# EAGLE design PowerBoard (EAGLE 6.6.0)
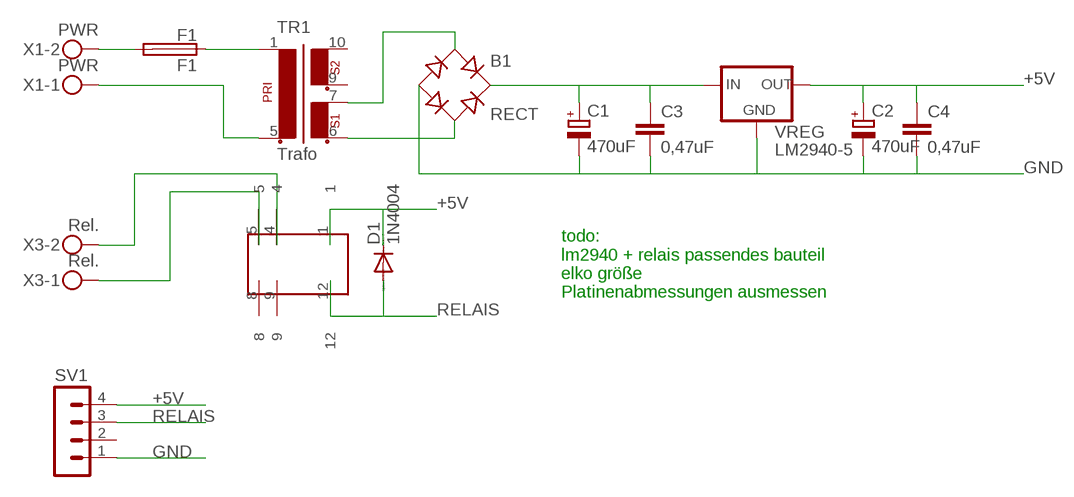
[diagram p0: schematic, sheet 1]

## Parts
B1  RECT  RECTIFIER-1KAB  [1KAB]
C1  470uF  CPOL-EUE5-6  [E5-6]
C2  470uF  CPOL-EUE5-6  [E5-6]
C3  0,47uF  C-EU025-030X050  [C025-030X050]
C4  0,47uF  C-EU025-030X050  [C025-030X050]
D1  1N4004  [DO41-10]
F1  F1  FUSEBLANK_5X20MM  [FUSE_HOLDER_5X20MM]
SV1  MA04-1  [MA04-1]
TR1  Trafo  EI30-2  [EI30-2]
U$1  V23079-A  [V23079-A]
VREG  LM2940-5  78MXXS  [78MXXS]
X1  PWR  MKDSN1,5/2-5,08  [MKDSN1,5/2-5,08]
X3  Rel.  MKDSN1,5/2-5,08  [MKDSN1,5/2-5,08]

## Nets
+5V: C2.+ C4.1 D1.C SV1.4 U$1.1 VREG.OUT
GND: B1.- C1.- C2.- C3.2 C4.2 SV1.1 VREG.GND
N$1: B1.AC2 TR1.6
N$2: B1.AC1 TR1.7
N$3: U$1.4 X3.2
N$4: B1.+ C1.+ C3.1 VREG.IN
N$5: U$1.5 X3.1
N$6: TR1.5 X1.1
N$7: F1.2 X1.2
RELAIS: D1.A SV1.3 U$1.12
TRAFO: F1.1 TR1.1
Unconnected: SV1.2 TR1.9 TR1.10 U$1.8 U$1.9

## Notes on the sheet
- todo:
  lm2940 + relais passendes bauteil
  elko größe
  Platinenabmessungen ausmessen

## Library data of the parts
B1 = rectifier:RECTIFIER-: Rectifier
C1 C2 = rcl:CPOL-EU: POLARIZED CAPACITOR, European symbol
C3 C4 = rcl:C-EU: CAPACITOR, European symbol
D1 = diode:1N4004: DIODE general purpose rectifier, 1 A
F1 = fuse:FUSE: Fuse; OC_FARNELL: unknown; OC_NEWARK: unknown
SV1 = con-lstb:MA04-1: PIN HEADER; OC_FARNELL: unknown; OC_NEWARK: unknown
TR1 = trafo:EI30-2: TRANSFORMER 1 primary winding, 2 secondary windings ERA
U$1 = Relais:V23079-A
VREG = v-reg:78MXXS: VOLTAGE REGULATOR
X1 X3 = con-phoenix-508:MKDSN1,5/2-5,08: MKDSN 1,5/ 2-5,08 Printklemme Nennstrom: 13,5 A Nennspannung: 250 V Rastermaß: 5,08 mm Polzahl: 2 Anschlussart: Schraubanschluss Montage: Löten Anschlussrichtung Leiter/Platine: 0 ° Artikelnummer: 1729128 Source: http://eshop.phoenixcontact.com .. 1729128.pdf

## Board
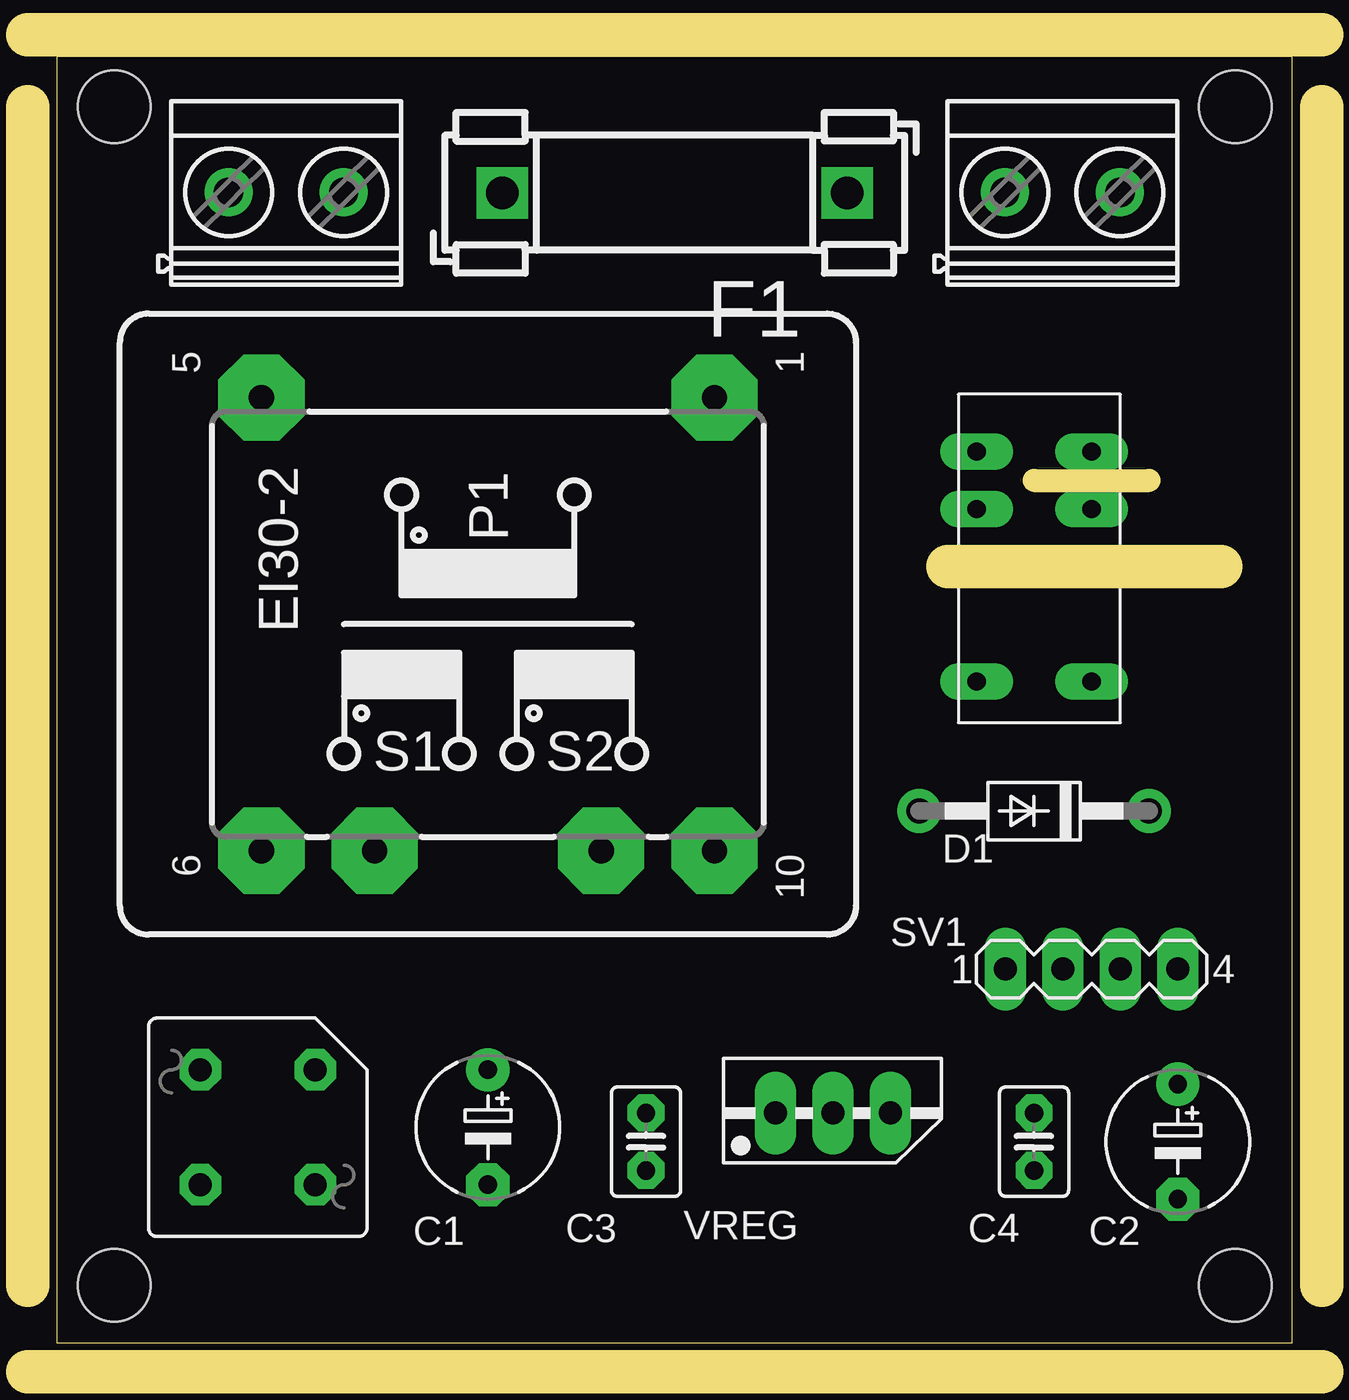
[diagram p1: board, top side]
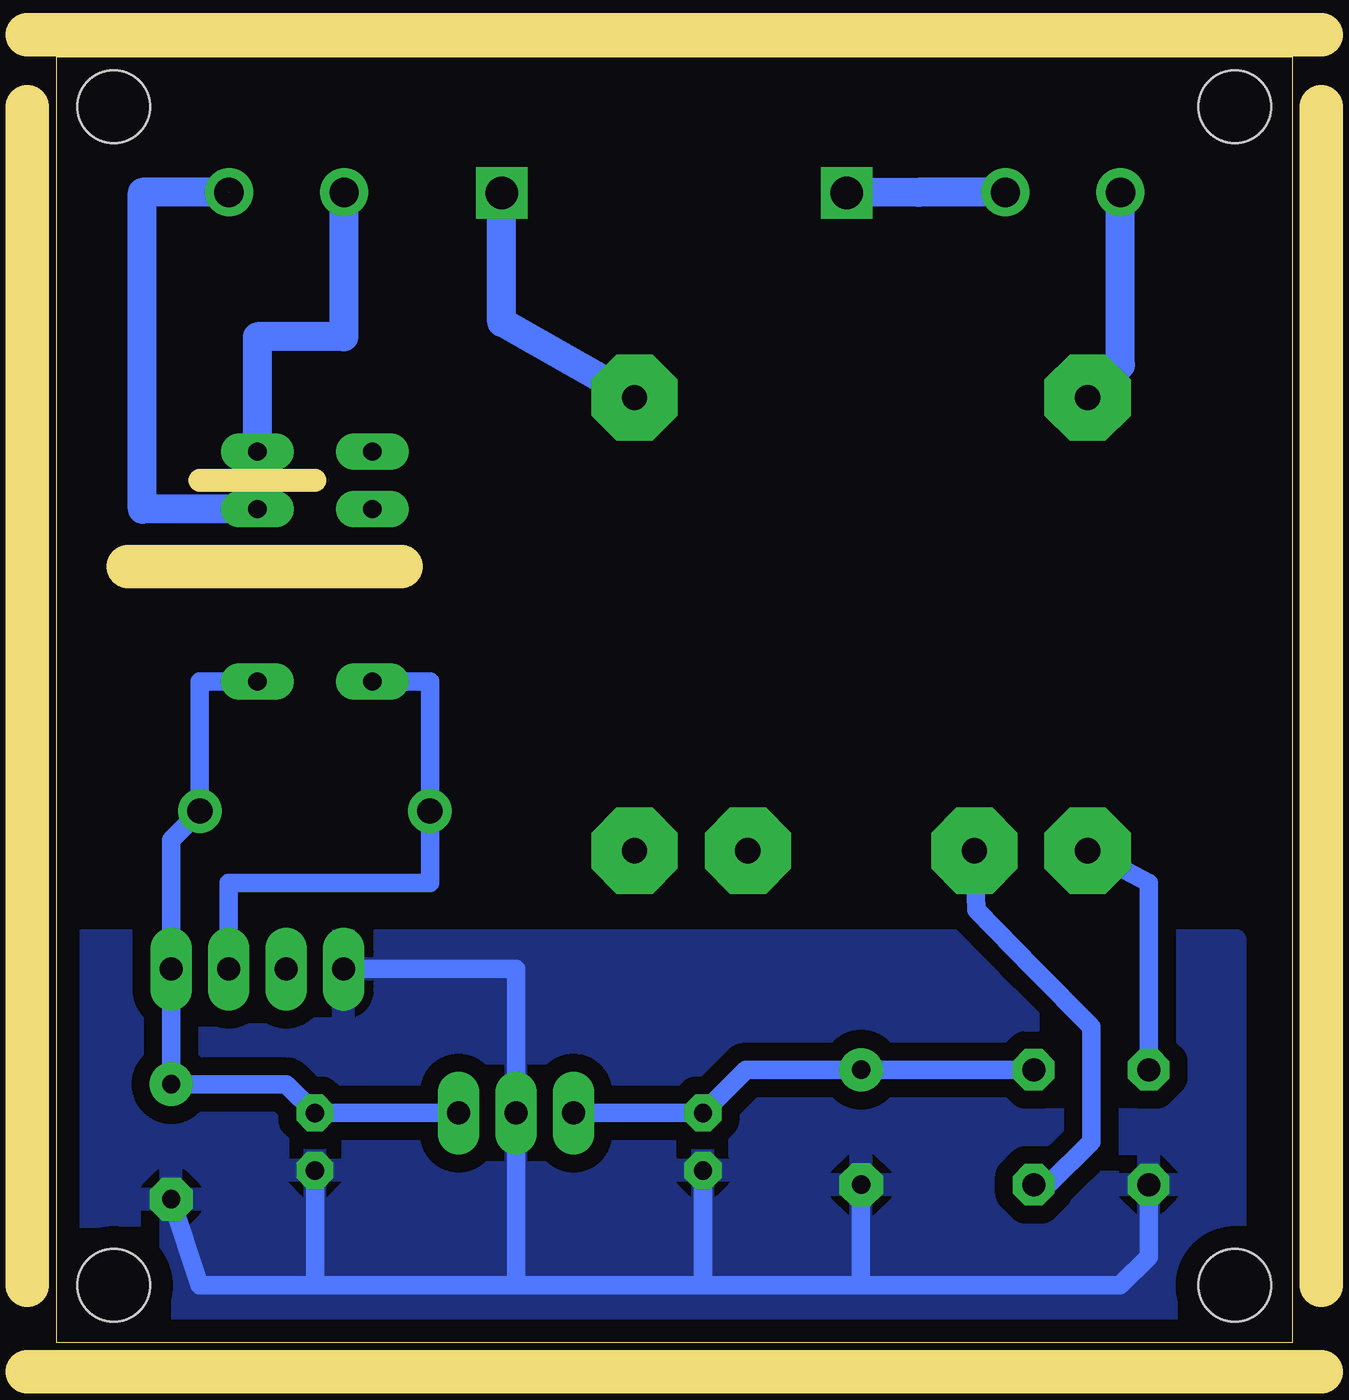
[diagram p2: board, bottom side, seen from below]

Size 54.59 x 56.82 mm. Coordinates in mm from the lower left corner, seen from the top.
Outline: 0,0 54.59,0 54.59,56.82 0,56.82 0,0
Copper layers (1*16): Top 0.035mm / dielectric 1.5mm / Bottom 0.035mm
Design rules "default": minimum track width 16mil, minimum drill 31mil, track to track 16mil, track to pad 16mil, pad to pad 16mil, via to via 16mil, smd to smd 16mil, copper to edge 40mil, drill to drill 8mil, minimum pad ring 16mil, minimum via ring 8mil, stop-mask expansion 4mil, vias tented up to drill 0mil, thermal gap 16mil
Holes 3.2 mm at 2.54,2.54 52.07,2.54 52.07,54.61 2.54,54.61
Milling: 6 lines

### Footprints (pad centres in the part's own frame; a part is rotated, then mirrored left to right if it is on the bottom)
1KAB = drill 1.016 octagon: + 2.54,-2.54; - -2.54,2.54; AC1 -2.54,-2.54; AC2 2.54,2.54
E5-6 = drill 0.813 pad 1.905: + -2.54,0 | drill 0.813 pad 1.905 octagon: - 2.54,0
C025-030X050 = drill 0.813 octagon: 1 -1.27,0; 2 1.27,0
DO41-10 = drill 1.118: A 5.08,0; C -5.08,0
FUSE_HOLDER_5X20MM = drill 1.422 pad 2.286 square: 1 0,0; 2 15.24,0
MA04-1 = drill 1.016 long: 1 -3.81,0; 2 -1.27,0; 3 1.27,0; 4 3.81,0
EI30-2 = drill 1.118 pad 3.81 octagon: 1 -10.008,10.008; 5 -10.008,-10.008; 6 10.008,-10.008; 7 10.008,-5.004; 9 10.008,5.004; 10 10.008,10.008
V23079-A = drill 0.8 long: 1 -2.54,5.08; 4 -2.54,-2.54; 5 -2.54,-5.08; 8 2.54,-5.08; 9 2.54,-2.54; 12 2.54,5.08
78MXXS = drill 1.016 long: GND 0,-2.54; IN -2.54,-2.54; OUT 2.54,-2.54
MKDSN1,5/2-5,08 = drill 1.3 pad 2: 1 -2.561,0.025; 2 2.519,0.025

### Placement (x,y rotation side)
B1  8.89,9.53 90 top
C1  19.05,9.53 270 top
C2  49.53,8.89 270 top
C3  26.04,8.89 270 top
C4  43.18,8.89 270 top
D1  43.18,23.5 180 top
F1  34.92,50.8 180 top
SV1  45.72,16.51 0 top
TR1  19.05,31.75 270 top
U$1  43.18,34.29 180 top
VREG  34.29,12.7 0 top
X1  10.16,50.8 0 top
X3  44.45,50.8 0 top

### Tracks (layer width: path | path; a pad name or v marks a point on that pad's centre or on a via)
+5V
  Bottom 0.813: U$1.1 48.26,29.21 D1.C 49.53,22.23 SV1.4 C2.+ 44.45,11.43 C4.1 VREG.OUT
GND
  Bottom 0.813: B1.- 6.35,3.81 7.62,2.54 19.05,2.54 | 19.05,2.54 26.04,2.54 | C1.- 19.05,2.54 | C3.2 26.04,2.54 | 34.29,2.54 VREG.GND 34.29,16.51 SV1.1 | 34.29,2.54 26.04,2.54 | C4.2 43.18,2.54 | 43.18,2.54 34.29,2.54 | C2.- 48.26,2.54 43.18,2.54
  pour Bottom (isolate 0.8): 53.34,17.78 2.54,17.78 2.54,1.27 53.34,1.27
N$1
  Bottom 0.813: TR1.6 6.35,20.32 B1.AC2
N$2
  Bottom 0.813: TR1.7 13.97,19.13 11.43,16.51 8.89,13.97 8.89,8.89 10.79,6.99 B1.AC1
N$3  (1 unrouted)
  Bottom 0.406: 50.8,50.82 50.8,50.8
  Bottom 1.27: U$1.4 50.8,36.83 50.8,50.8 | X3.2 50.8,50.82
N$4
  Bottom 0.813: B1.+ C1.+ 24.13,12.06 C3.1 VREG.IN
N$5
  Bottom 1.27: X3.1 41.91,50.8 41.91,44.45 45.72,44.45 U$1.5
N$6
  Bottom 1.27: X1.1 7.6,43.2 TR1.5
N$7
  Bottom 1.27: X1.2 16.51,50.83 F1.2
RELAIS
  Bottom 0.813: U$1.12 38.1,29.21 D1.A 38.1,20.32 46.99,20.32 SV1.3
TRAFO
  Bottom 1.27: TR1.1 34.92,45.09 F1.1